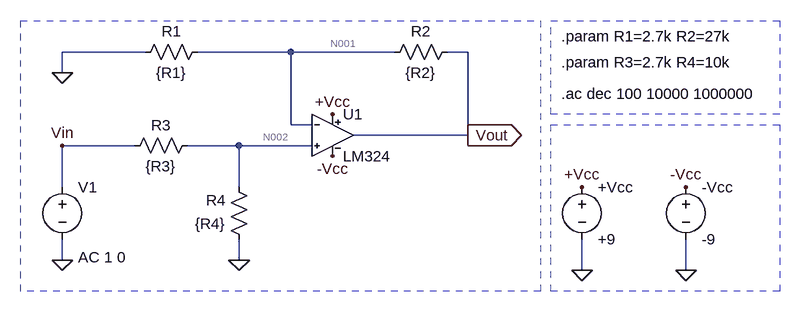
[diagram p0: schematic NoInversorCaso1.asc]
NoInversorCaso1.asc, the LTspice schematic file:
Version 4
SHEET 1 1188 680
WIRE -80 32 -208 32
WIRE 144 32 0 32
WIRE 304 32 144 32
WIRE 416 32 384 32
WIRE -208 64 -208 32
WIRE 144 144 144 32
WIRE 176 144 144 144
WIRE 416 160 416 32
WIRE 416 160 240 160
WIRE -96 176 -208 176
WIRE 64 176 -16 176
WIRE 176 176 64 176
WIRE -208 240 -208 176
WIRE 64 240 64 176
WIRE -208 352 -208 320
WIRE 64 352 64 320
WIRE 592 368 592 320
WIRE 752 368 752 320
FLAG -208 352 0
FLAG 64 352 0
FLAG 416 160 Vout
IOPIN 416 160 Out
FLAG 208 128 +Vcc
FLAG 208 192 -Vcc
FLAG -208 176 Vin
FLAG 592 368 0
FLAG 752 368 0
FLAG 592 240 +Vcc
FLAG 752 240 -Vcc
FLAG -208 64 0
SYMBOL FACUsym\\LM324 208 160 R0
SYMATTR InstName U1
SYMBOL voltage -208 224 R0
WINDOW 123 24 124 Left 2
WINDOW 39 0 0 Left 0
SYMATTR Value2 AC 1 0
SYMATTR InstName V1
SYMATTR Value ""
SYMBOL res 0 160 R90
WINDOW 0 0 56 VBottom 2
WINDOW 3 32 56 VTop 2
SYMATTR InstName R3
SYMATTR Value {R3}
SYMBOL res 400 16 R90
WINDOW 0 0 56 VBottom 2
WINDOW 3 32 56 VTop 2
SYMATTR InstName R2
SYMATTR Value {R2}
SYMBOL res -96 48 R270
WINDOW 0 32 56 VTop 2
WINDOW 3 0 56 VBottom 2
SYMATTR InstName R1
SYMATTR Value {R1}
SYMBOL res 80 336 R180
WINDOW 0 36 76 Left 2
WINDOW 3 36 40 Left 2
SYMATTR InstName R4
SYMATTR Value {R4}
SYMBOL voltage 592 224 R0
SYMATTR InstName +Vcc
SYMATTR Value +9
SYMBOL voltage 752 224 R0
SYMATTR InstName -Vcc
SYMATTR Value -9
TEXT 560 8 Left 2 !.param R1=2.7k R2=27k
TEXT 560 96 Left 2 !.ac dec 100 10000 1000000
TEXT 560 48 Left 2 !.param R3=2.7k R4=10k
RECTANGLE Normal 528 400 -272 -16 2
RECTANGLE Normal 896 128 544 -16 2
RECTANGLE Normal 896 400 544 144 2

The netlist it stands for:
* NoInversorCaso1.asc
XU1 N002 N001 +Vcc -Vcc Vout LM324 LM324  ; pins In+ In- V+ V- OUT
V1 Vin 0 AC 1 0
R3 N002 Vin {R3}
R2 Vout N001 {R2}
R1 0 N001 {R1}
R4 0 N002 {R4}
V§+Vcc +Vcc 0 +9
V§-Vcc -Vcc 0 -9
.param R1=2.7k R2=27k
.ac dec 100 10000 1000000
.param R3=2.7k R4=10k
.lib FACUsub/LM324.lib
.backanno
.end

* Results of the author's LTspice run, read from the files saved beside the schematic
* Operating Point, zero values left out:
*   V(vout) = -442.7 µV
*   V(-vcc) = -9 V
*   V(+vcc) = 9 V
*   V(n001) = 8.704 µV
*   V(n002) = 42.36 µV
*   I(R4) = -4.236 nA
*   I(R1) = -3.224 nA
*   I(R2) = -16.72 nA
*   I(R3) = 15.69 nA
*   I(-vcc) = 603.8 µA
*   I(+vcc) = -603.9 µA
*   I(V1) = 15.69 nA
*   Ix(u1:1) = -19.92 nA
*   Ix(u1:2) = -19.94 nA
*   Ix(u1:3) = 603.9 µA
*   Ix(u1:4) = -603.8 µA
*   Ix(u1:5) = 16.72 nA
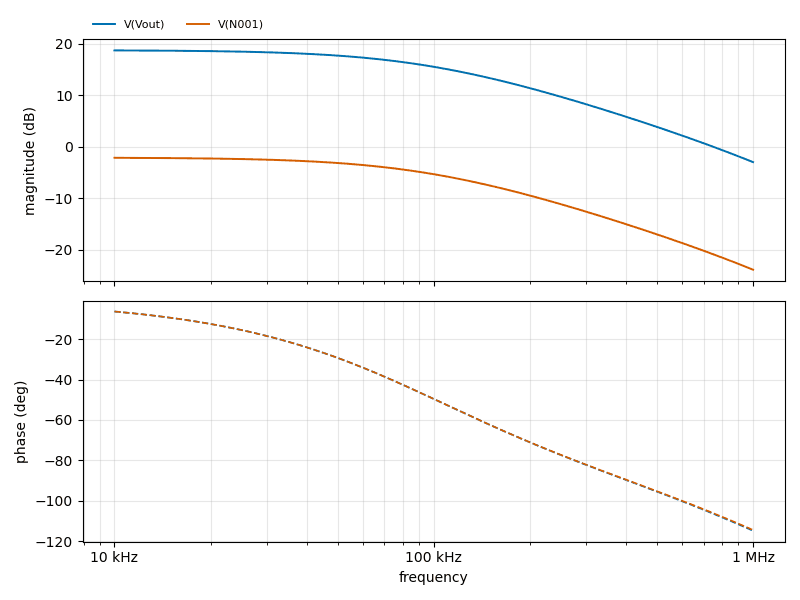
[diagram p1: AC Analysis of NoInversorCaso1.asc, plotted from the saved traces]
* AC Analysis, 1 run:
*   V(Vout): 18.70 dB at 10 kHz, -2.96 dB at 1 MHz, peak 18.70 dB at 10 kHz, 3 dB below the peak at 96.3 kHz
*   V(N001): -2.12 dB at 10 kHz, -23.82 dB at 1 MHz, peak -2.12 dB at 10 kHz, 3 dB below the peak at 96.29 kHz